# EAGLE design pcb_rfic_nrf905_final (EAGLE 9.6.1)
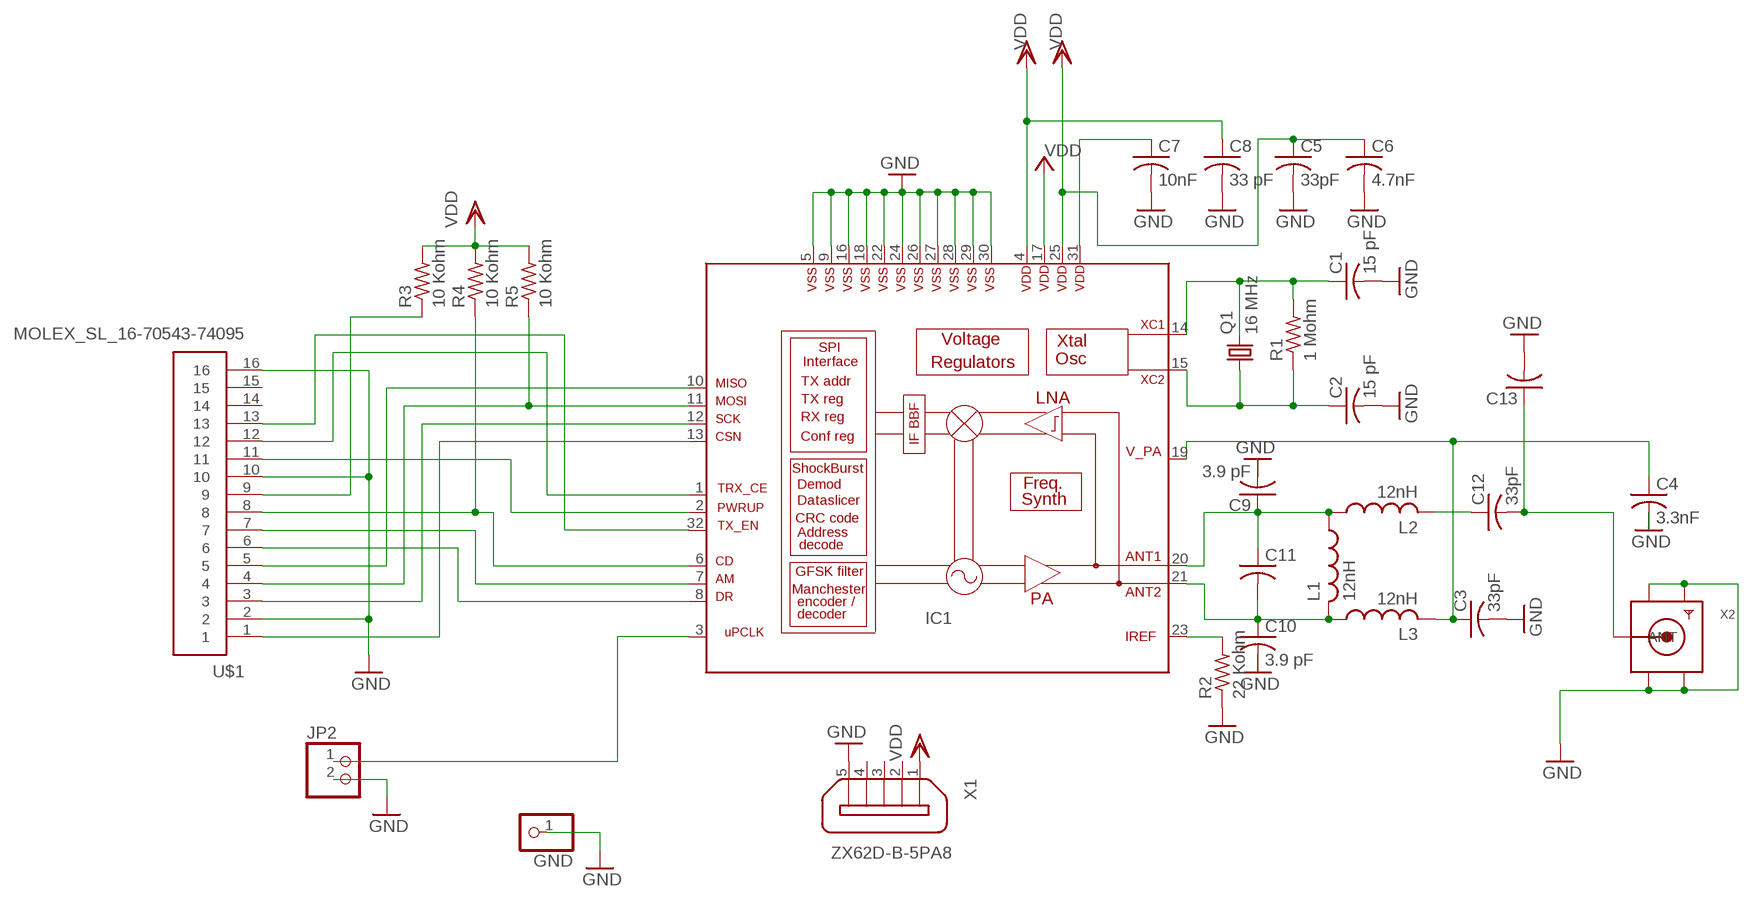
[diagram p0: schematic, sheet 1]

## Parts
C1  15 pF  C-USC0603  [C0603]
C2  15 pF  C-USC0603  [C0603]
C3  33pF  C-USC0603  [C0603]
C4  3.3nF  C-USC0603  [C0603]
C5  33pF  C-USC0603  [C0603]
C6  4.7nF  C-USC0603  [C0603]
C7  10nF  C-USC0603  [C0603]
C8  33 pF  C-USC0603  [C0603]
C9  3.9 pF  C-USC0603  [C0603]
C10  3.9 pF  C-USC0603  [C0603]
C11  C-USC0603  [C0603]
C12  33pF  C-USC0603  [C0603]
C13  C-USC0603  [C0603]
GND  PINHD-1X1  [1X01]
IC1  NRF905  [LQFP-32]
JP2  PINHD-1X2  [1X02]
L1  12nH  L-US0204V  [0204V]
L2  12nH  L-US0204V  [0204V]
L3  12nH  L-US0204V  [0204V]
Q1  16 MHz  CRYSTALHC18U-V  [HC18U-V]
R1  1 Mohm  R-US_R0603  [R0603]
R2  22 Kohm  R-US_R0603  [R0603]
R3  10 Kohm  R-US_R0603  [R0603]
R4  10 Kohm  R-US_R0603  [R0603]
R5  10 Kohm  R-US_R0603  [R0603]
U$1  MOLEX_SL_16-70543-74095  [SL_70543_16]
X1  ZX62D-B-5PA8  [ZX62D-B-5PA8]
X2  SMACONNECTOR_EDGE  [SMA_EDGELAUNCH]

## Nets
GND: C1.2 C2.2 C3.2 C4.2 C5.2 C6.2 C7.2 C8.2 C9.2 C10.2 C13.2 GND.1 IC1.5(VSS5) IC1.9(VSS9) IC1.16(VSS16) IC1.18(VSS18) IC1.22(VSS22) IC1.24(VSS24) IC1.26(VSS26) IC1.27(VSS27) IC1.28(VSS28) IC1.29(VSS29) IC1.30(VSS30) JP2.2 R2.1 U$1.2 U$1.10 U$1.16 X1.5 X2.GND@1(GND4) X2.GND@2(GND3) X2.GND@3(GND2) X2.GND@4(GND1)
N$1: C1.1 IC1.14(XC1) Q1.2 R1.2
N$2: C2.1 IC1.15(XC2) Q1.1 R1.1
N$3: IC1.23(IREF) R2.2
N$4: C7.1 IC1.31(DVDD1V2)
N$5: C9.1 C11.1 IC1.20(ANT1) L1.1 L2.1
N$7: C10.1 C11.2 IC1.21(ANT2) L1.2 L3.1
N$8: C12.1 L2.2
N$9: C3.1 C4.1 IC1.19(VDD_PA) L3.2
N$10: IC1.10(MISO) U$1.5
N$11: IC1.11(MOSI) R5.1 U$1.4
N$12: IC1.12(SCK) U$1.3
N$13: R3.1 U$1.9
N$14: IC1.1(TRX_CE) U$1.12
N$15: IC1.2(PWR_UP) U$1.11
N$16: IC1.32(TX_EN) U$1.13
N$17: IC1.6(CD) R4.1 U$1.8
N$18: IC1.7(AM) U$1.7
N$19: IC1.8(DR) U$1.6
N$20: IC1.3(UPCLK) JP2.1
N$21: IC1.13(CSN) U$1.1
N$24: C12.2 C13.1 X2.P(ANT)
VCC: IC1.17(VDD17)
VDD: C5.1 C6.1 C8.1 IC1.4(VDD4) IC1.25(VDD25) R3.2 R4.2 R5.2 X1.1
Unconnected: U$1.14 U$1.15 X1.2 X1.3 X1.4 X1.S1 X1.S2 X1.S3 X1.S4

## Library data of the parts
C1 C2 = adafruit:C-US: CAPACITOR, American symbol; MF: MULTICOMP PRO; MPN: MCMT18N150F500CT; OC_NEWARK: 03AC2905
C3 C5 C12 = adafruit:C-US: CAPACITOR, American symbol; MF: MULTICOMP PRO; MPN: MCMT18N330F100CT; OC_NEWARK: 03AC2918
C4 = adafruit:C-US: CAPACITOR, American symbol; MF: KEMET; MPN: C0603C332J5JACTU; OC_NEWARK: 01AC8337
C6 = adafruit:C-US: CAPACITOR, American symbol; MF: KEMET; MPN: C0603X472K5RAC3316; OC_NEWARK: 01AC1585
C7 = adafruit:C-US: CAPACITOR, American symbol; MF: TDK; MPN: CGA3E2C0G1H103J080AA; OC_NEWARK: 04X3152
C8 = adafruit:C-US: CAPACITOR, American symbol; MF: KEMET; MPN: C0603C330J5GACTU; OC_NEWARK: 64K2857
C9 C10 = adafruit:C-US: CAPACITOR, American symbol; MF: AVX; MPN: 06035A3R9DAT2A; OC_NEWARK: 10AH1929
C11 C13 = adafruit:C-US: CAPACITOR, American symbol; OC_NEWARK: unknown
GND = adafruit:PINHD-1X1: Pin header 1x1 for 0.1" spacing With round pins; MF: VISHAY; MPN: VO615A-1X019T; OC_NEWARK: 48W3690
IC1 = nordic-semi:NRF905: RF TRANSCEIVER; OC_NEWARK: unknown
JP2 = pinhead:PINHD-1X2: PIN HEADER; OC_NEWARK: unknown
L1-L3 = rcl:L-US: INDUCTOR, American symbol; MF: MULTICOMP PRO; MPN: MCFT000084; OC_NEWARK: 10R8619; SPICEPREFIX: L
Q1 = adafruit:CRYSTAL: CRYSTAL; OC_FARNELL: unknown; OC_NEWARK: unknown
R1 = rcl_2:R-US_: RESISTOR, American symbol; MF: MULTICOMP PRO; MPN: MCWR06X1004FTL; OC_NEWARK: 01Y7500
R2 R3 = rcl_2:R-US_: RESISTOR, American symbol; OC_NEWARK: unknown
R4 R5 = adafruit:R-US_: RESISTOR, American symbol; OC_NEWARK: unknown
U$1 = molex-sl-connectors_jw:MOLEX_SL_16: Molex SL-Series PCB Header, 16-Pos, 0.1" (2.54mm) Centers; OC_NEWARK: unknown
X1 = zx62d-b-5pa8-oshpark_10:ZX62D-B-5PA8: Micro USB Type B Connector - Standard, Shell Through Hole Source: http://www.hirose.co.jp/cataloge_hp/ed_ZX_20140804.pdf; MF: Hirose; MPN: ZX62D-B-5PA8; OC_FARNELL: 2300438; OC_NEWARK: unknown
X2 = adafruit:SMACONNECTOR: SMA Connector 90° DIP SMA Connector, 50 Ohm (4UConnector: 07259); OC_NEWARK: unknown

## Board
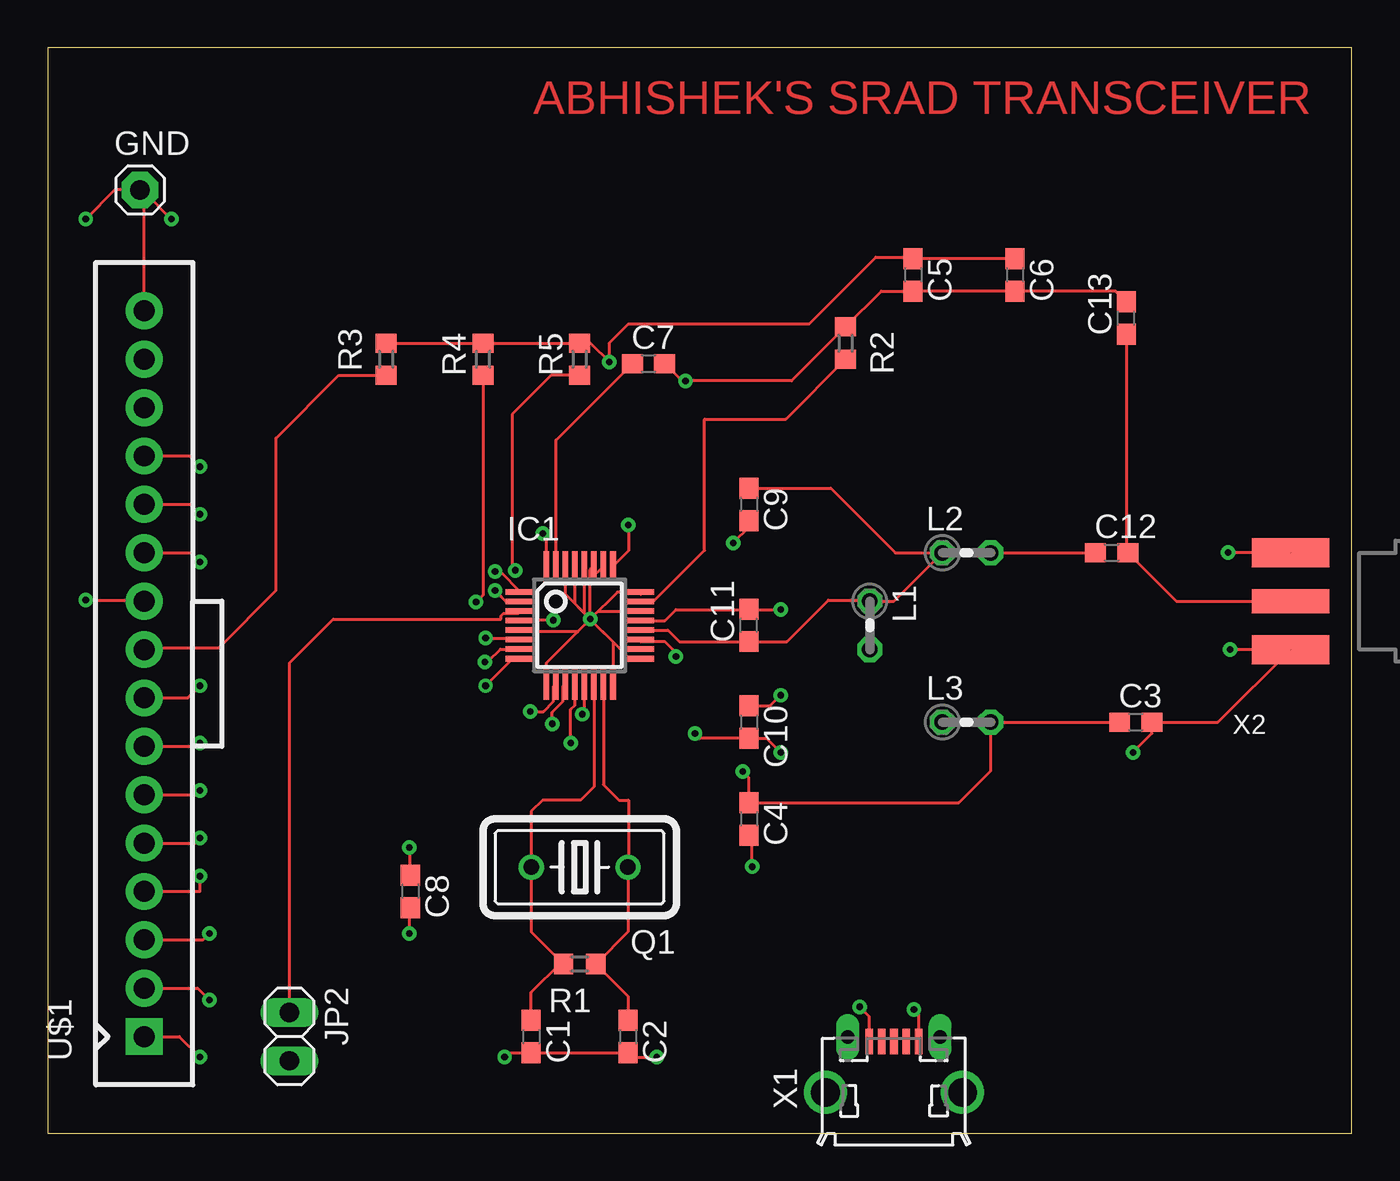
[diagram p1: board, top side]
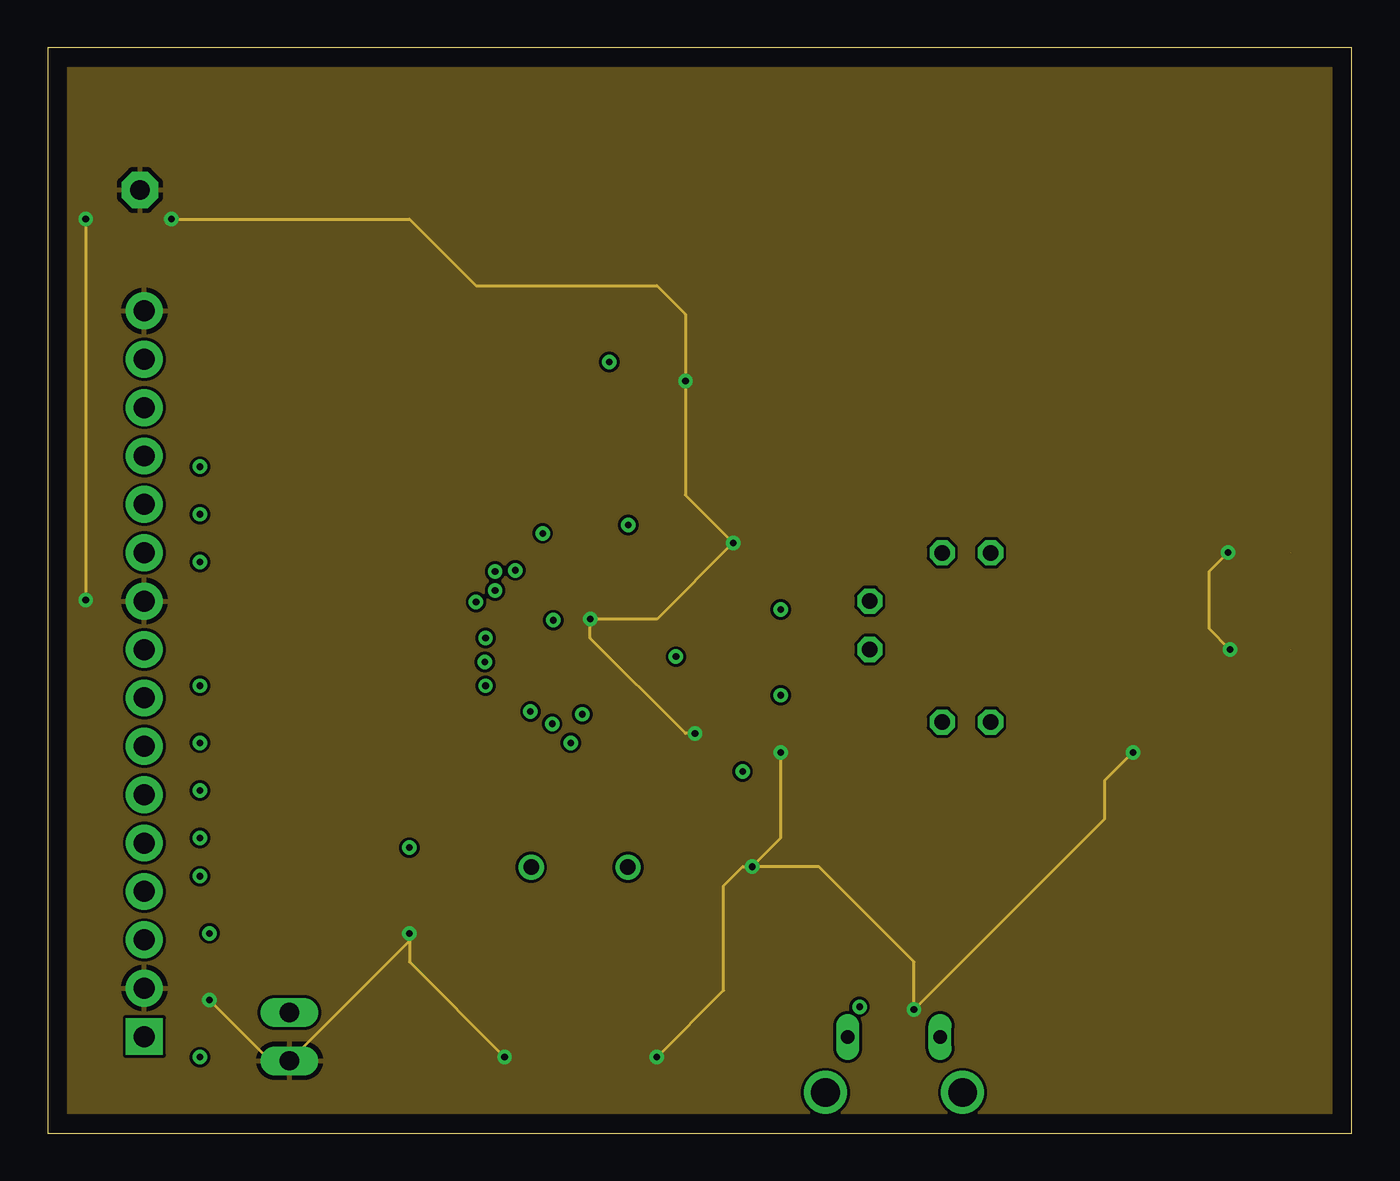
[diagram p2: board, inner layer Route2]
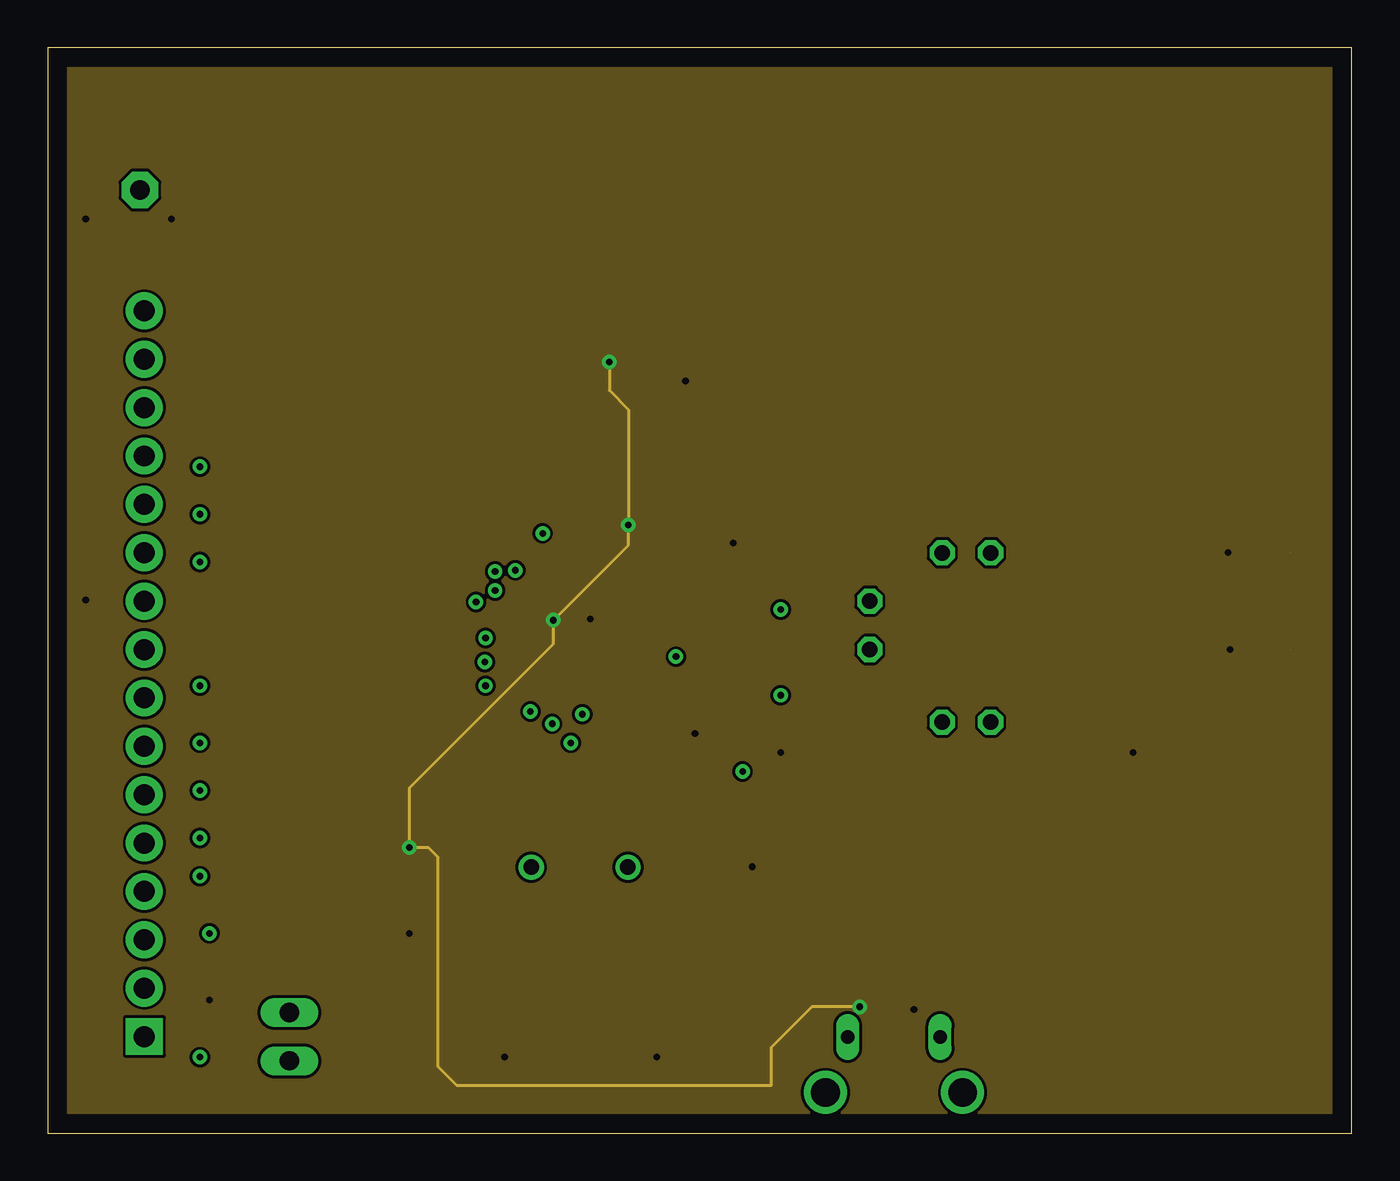
[diagram p3: board, inner layer Route15]
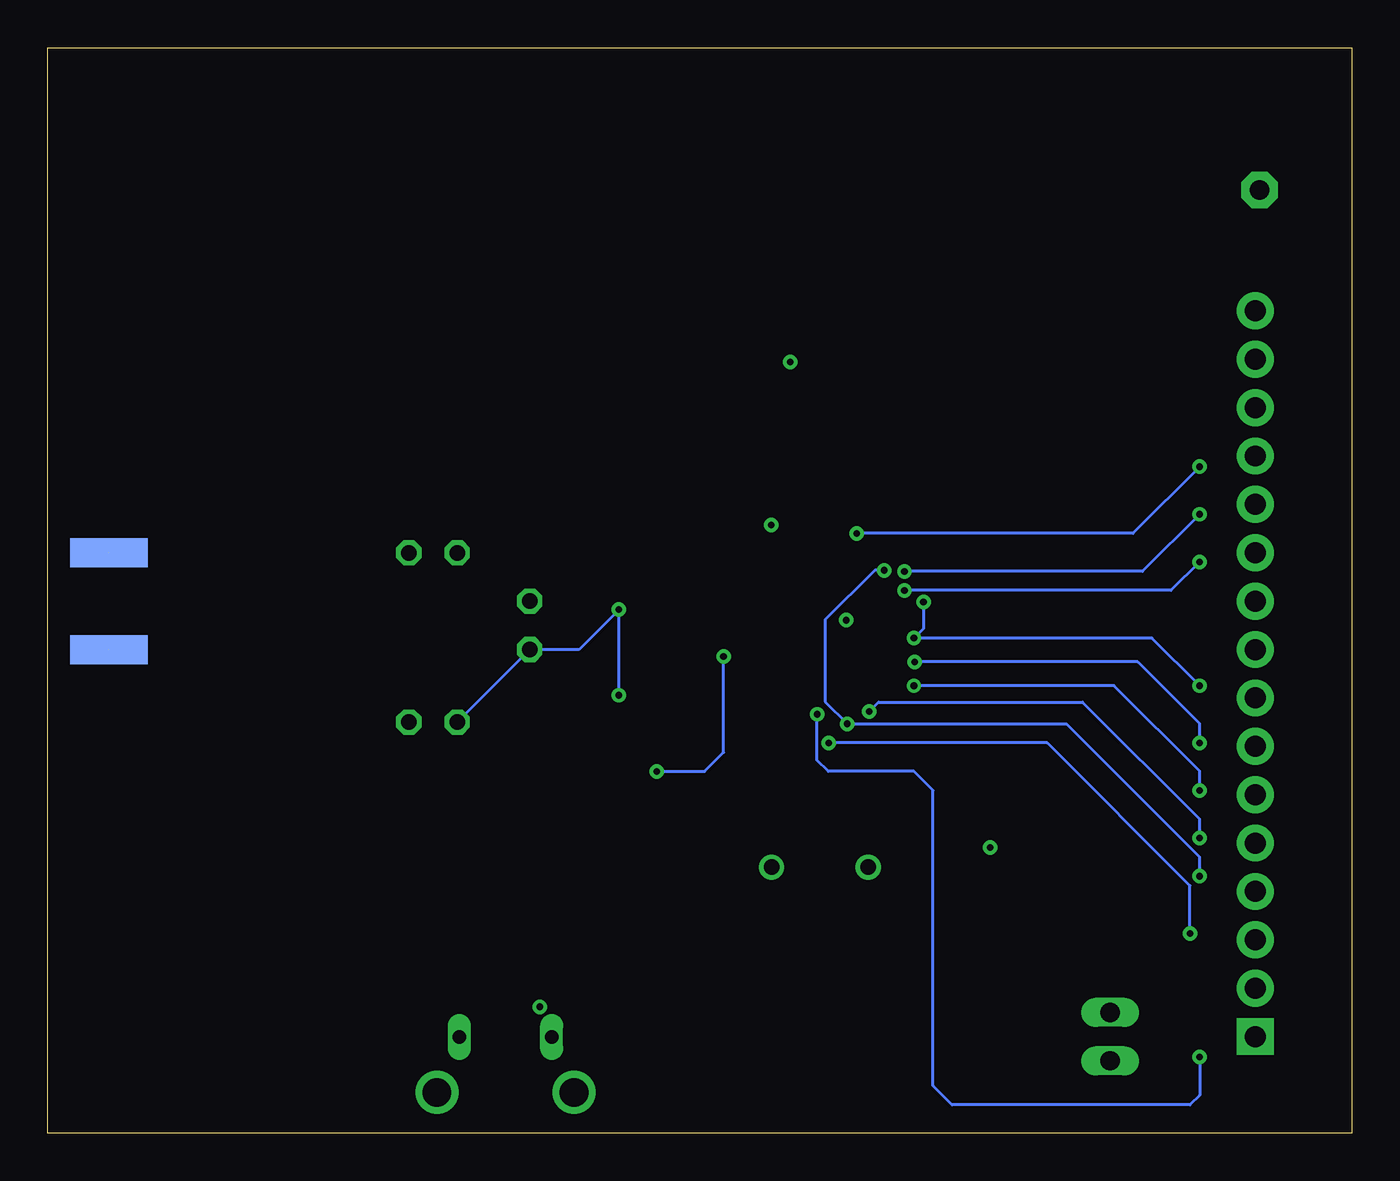
[diagram p4: board, bottom side, seen from below]

Size 68.5 x 57 mm. Coordinates in mm from the lower left corner, seen from the top.
Outline: 0,0 68.5,0 68.5,57 0,57 0,0
Copper layers ([2:1+(2*15)+16:15]): Top 0.035mm / dielectric 0.35mm / Route2 0.035mm / dielectric 0.7mm / Route15 0.035mm / dielectric 0.35mm / Bottom 0.035mm
Design rules "default *": minimum track width 6mil, minimum drill 0.35mm, track to track 6mil, track to pad 6mil, pad to pad 6mil, via to via 6mil, smd to smd 6mil, copper to edge 40mil, drill to drill 6mil, minimum pad ring 10mil, minimum via ring 8mil, stop-mask expansion 4mil, vias tented up to drill 0mil, thermal gap 10mil

### Footprints (pad centres in the part's own frame; a part is rotated, then mirrored left to right if it is on the bottom)
C0603 = smd 1.1 x 1: 1 -0.85,0; 2 0.85,0
1X01 = drill 1.016 pad 1.93 octagon: 1 0,0
LQFP-32 = smd 0.3 x 1.6: 1 -1.75,-3.1; 2 -1.25,-3.1; 3 -0.75,-3.1; 4 -0.25,-3.1; 5 0.25,-3.1; 6 0.75,-3.1; 7 1.25,-3.1; 8 1.75,-3.1; 17 1.75,3.1; 18 1.25,3.1; 19 0.75,3.1; 20 0.25,3.1; 21 -0.25,3.1; 22 -0.75,3.1; 23 -1.25,3.1; 24 -1.75,3.1 | smd 1.6 x 0.3: 9 3.1,-1.75; 10 3.1,-1.25; 11 3.1,-0.75; 12 3.1,-0.25; 13 3.1,0.25; 14 3.1,0.75; 15 3.1,1.25; 16 3.1,1.75; 25 -3.1,1.75; 26 -3.1,1.25; 27 -3.1,0.75; 28 -3.1,0.25; 29 -3.1,-0.25; 30 -3.1,-0.75; 31 -3.1,-1.25; 32 -3.1,-1.75
1X02 = drill 1.016 long: 1 -1.27,0; 2 1.27,0
0204V = drill 0.813 octagon: 1 -1.27,0; 2 1.27,0
HC18U-V = drill 0.813: 1 -2.54,0; 2 2.54,0
R0603 = smd 1 x 1.1: 1 -0.85,0; 2 0.85,0
SL_70543_16 = drill 1.1 pad 1.93 square: 1 -19.05,1.27 | drill 1.1 pad 1.93: 2 -16.51,1.27; 3 -13.97,1.27; 4 -11.43,1.27; 5 -8.89,1.27; 6 -6.35,1.27; 7 -3.81,1.27; 8 -1.27,1.27; 9 1.27,1.27; 10 3.81,1.27; 11 6.35,1.27; 12 8.89,1.27; 13 11.43,1.27; 14 13.97,1.27; 15 16.51,1.27; 16 19.05,1.27
ZX62D-B-5PA8 = smd 1.35 x 0.4: 1 4.825,1.3; 2 4.825,0.65; 3 4.825,0; 4 4.825,-0.65; 5 4.825,-1.3 | drill 1.5: S1 2.15,-3.6; S2 2.15,3.6 | drill 0.7 long: S3 5.05,2.425; S4 5.05,-2.425
SMA_EDGELAUNCH = smd 4.064 x 1.524: GND@1 2.032,-2.54; GND@2 2.032,2.54 | smd 4.064 x 1.524 bottom: GND@3 2.032,2.54; GND@4 2.032,-2.54 | smd 4.064 x 1.27: P 2.032,0

### Placement (x,y rotation side)
C1  25.4,5.08 270 top
C2  30.48,5.08 270 top
C3  57.15,21.59 0 top
C4  36.83,16.51 270 top
C5  45.45,45.07 270 top
C6  50.8,45.07 270 top
C7  31.56,40.41 0 top
C8  19.05,12.7 270 top
C9  36.83,33.02 270 top
C10  36.83,21.59 270 top
C11  36.83,26.67 90 top
C12  55.88,30.48 0 top
C13  56.65,42.8 90 top
GND  4.85,49.53 0 top
IC1  27.94,26.67 270 top
JP2  12.7,5.08 270 top
L1  43.18,26.67 270 top
L2  48.26,30.48 0 top
L3  48.26,21.59 0 top
Q1  27.94,13.97 180 top
R1  27.94,8.89 180 top
R2  41.91,41.49 270 top
R3  17.78,40.64 90 top
R4  22.86,40.64 90 top
R5  27.94,40.64 90 top
U$1  6.35,24.13 90 top
X1  44.45,0 90 top
X2  67.31,27.94 180 top

### Tracks (layer width: path | path; a pad name or v marks a point on that pad's centre or on a via)
GND  (via drill 0.35 layers 1-2)  (2 unrouted)
  Top 0.152: 5.08,49.42 v6.5,48 | v2,48 3.53,49.53 GND.1 4.97,49.53 5.08,49.42 | v2,28 5.02,28 U$1.10 | U$1.16 5.08,49.42 | C7.2 33.32,39.5 v33.5,39.5 39.07,39.5 R2.1 43.79,44.22 C5.2 C6.2 56.08,44.22 C13.2 | U$1.2 7.88,7.62 v8.5,7 | v19,10.5 19,11.8 C8.2 | v24,4 24.23,4.23 C1.2 C2.2 30.71,4 v32,4 | v37,14 37,15.49 C4.2 | X1.5 45.75,6.25 v45.5,6.5 | v57,20 58,21 C3.2 61.47,21.59 X2.GND@3 v62.1,25.4 | v38.5,20 37.76,20.74 C10.2 34.26,20.74 v34,21 | v62,30.5 65.26,30.5 X2.GND@4 | C9.2 36.83,31.83 v36,31 | v28.5,27 28.92,27.42 IC1.22 | 31.16,28.3 IC1.24 29.92,28.42 v28.5,27 | v28.5,27 30.08,25.42 IC1.18 | v28.5,27 29.69,25.81 IC1.16 | v28.5,27 26.19,24.69 IC1.9 | IC1.5 25.72,26.42 25.81,26.33 27.83,26.33 v28.5,27 | v28.5,27 27.19,28.31 IC1.30 | v28.5,27 27.69,27.81 IC1.29 | v28.5,27 28.19,27.31 IC1.28 | v28.5,27 28.5,29.58 IC1.27 | v28.5,27 28.5,29.08 IC1.26
  Route2 0.152: v2,48 v2,28 | 6.26,47.76 v6.5,48 19,48 22.5,44.5 32,44.5 33.5,43 v33.5,39.5 33.5,33.5 v36,31 32,27 v28.5,27 28.5,26 33.5,21 v34,21 | v8.5,7 11.69,3.81 JP2.2 19,10.11 v19,10.5 19,9 v24,4 | v37,14 36.5,14 35.5,13 35.5,7.5 v32,4 | v57,20 55.5,18.5 55.5,16.5 v45.5,6.5 45.5,9 40.5,14 v37,14 | v38.5,20 38.5,15.5 v37,14 | v62.1,25.4 61,26.5 61,29.5 v62,30.5
  pour Route2: -0.5,-0.5 -0.5,57.5 69,57.5 69,-0.5
N$1
  Top 0.152: IC1.14 28.69,18.19 28,17.5 26,17.5 25.4,16.9 Q1.2 25.4,10.58 26.99,8.99 | 26.99,8.99 R1.2 | C1.1 25.4,7.4 26.99,8.99
N$2
  Top 0.152: IC1.15 29.19,18.31 30,17.5 30.5,17.5 30.5,13.99 Q1.1 30.48,10.58 R1.1 30.48,7.2 C2.1
N$3
  Top 0.152: IC1.23 31.11,27.99 31.89,27.99 34.5,30.61 34.5,37.5 38.77,37.5 R2.2
N$4
  Top 0.152: IC1.31 26.69,36.39 C7.1
N$5
  Top 0.152: C9.1 41.13,33.87 44.52,30.48 L2.1 44.45,27.94 L1.1 43.12,28 41,28 38.82,25.82 C11.1 33.18,25.82 32.58,26.42 IC1.20
N$7  (via drill 0.35)
  Top 0.152: C11.2 36.85,27.5 | 36.85,27.5 v38.5,27.5 | IC1.21 32.42,26.92 33,27.5 36.85,27.5 | C10.1 37.94,22.44 v38.5,23
  Bottom 0.152: v38.5,23 v38.5,27.5 40.6,25.4 L1.2 L3.1
N$8
  Top 0.152: L2.2 C12.1
N$9  (via drill 0.35)
  Top 0.152: v36.5,19 36.83,18.67 C4.1 47.86,17.36 49.53,19.03 L3.2 C3.1 | IC1.19 31.16,25.8 32.44,25.8 33,25.23 v33,25.03
  Bottom 0.152: v36.5,19 34,19 33,20 v33,25.03
N$10  (via drill 0.35)
  Top 0.152: U$1.5 7.74,15.24 v8,15.5 | IC1.10 26.57,23.45 26.57,22.68 26.04,22.14 v25.36,22.14
  Bottom 0.152: v8,15.5 8,16.5 14.14,22.64 24.86,22.64 v25.36,22.14
N$11  (via drill 0.35)
  Top 0.152: U$1.4 8,12.7 v8,13.5 | IC1.11 27.07,23.45 27.07,22.68 26.5,22.11 v26.5,21.5 | v24.56,29.56 24.39,29.73 24.39,37.75 26.43,39.79 R5.1
  Bottom 0.152: v8,13.5 8,14.5 15,21.5 v26.5,21.5 27.67,22.67 27.67,26.95 25.06,29.56 v24.56,29.56
N$12  (via drill 0.35)
  Top 0.152: U$1.3 8.16,10.16 v8.5,10.5 | IC1.12 27.69,22.46 27.48,22.25 v27.48,20.5
  Bottom 0.152: v8.5,10.5 8.5,13 16,20.5 v27.48,20.5
N$13
  Top 0.152: U$1.9 5.18,25.5 9,25.5 12,28.5 12,36.5 15.29,39.79 R3.1
N$14  (via drill 0.35)
  Top 0.152: U$1.12 7.48,33.02 v8,32.5 | v23.5,29.5 23.76,29.5 IC1.1
  Bottom 0.152: v8,32.5 11,29.5 v23.5,29.5
N$15  (via drill 0.35)
  Top 0.152: U$1.11 7.52,30.48 v8,30 | v23.5,28.5 23.81,28.19 23.81,28.18 24.07,27.92 IC1.2
  Bottom 0.152: v8,30 9.5,28.5 v23.5,28.5
N$16  (via drill 0.35)
  Top 0.152: U$1.13 7.44,35.56 v8,35 | v26,31.5 26.19,31.31 IC1.32
  Bottom 0.152: v8,35 11.5,31.5 v26,31.5
N$17  (via drill 0.35)
  Top 0.152: U$1.8 7.36,22.86 v8,23.5 | v23,26 24.76,26 IC1.6 | R4.1 22.86,28.25 v22.5,27.89
  Bottom 0.152: v8,23.5 10.5,26 v23,26 22.5,26.5 v22.5,27.89
N$18  (via drill 0.35)
  Top 0.152: U$1.7 7.82,20.32 v8,20.5 | IC1.7 23.78,25.42 23.11,24.75 v22.96,24.75
  Bottom 0.152: v8,20.5 8,21.5 11.25,24.75 v22.96,24.75
N$19  (via drill 0.35)
  Top 0.152: U$1.6 7.78,17.78 v8,18 | IC1.8 24.42,24.92 v23,23.5
  Bottom 0.152: v8,18 8,19 12.5,23.5 v23,23.5
N$20
  Top 0.152: JP2.1 12.7,24.7 15,27 23.81,27 23.81,27.16 23.95,27.3 24.72,27.3 IC1.3
N$21  (via drill 0.35)
  Top 0.152: U$1.1 6.92,5.08 v8,4 | v28.08,22 28.19,22.11 IC1.13
  Bottom 0.152: v8,4 8,2 8.5,1.5 21,1.5 22,2.5 22,18 23,19 27.5,19 28.08,19.58 v28.08,22
N$24
  Top 0.152: C13.1 56.65,30.56 C12.2 59.27,27.94 X2.P
VDD  (via drill 0.35)
  Top 0.152: R3.2 R4.2 R5.2 28.51,41.49 v29.5,40.5 29.5,41.5 30.5,42.5 40,42.5 43.5,46 45.37,46 C5.1 C6.1 | C8.1 19.05,14.95 v19,15 | v26.56,26.94 24.86,26.94 IC1.4 | v30.5,31.94 30.5,30.58 IC1.25 | X1.1 43.15,6.13 v42.64,6.64
  Route15 0.152: v29.5,40.5 29.5,39 30.5,38 v30.5,31.94 30.5,30.88 v26.56,26.94 26.56,25.7 19,18.14 v19,15 20,15 20.5,14.5 20.5,3.5 21.5,2.5 38,2.5 38,4.5 40.14,6.64 v42.64,6.64
  pour Route15: -1,-1 -1,58 69.5,58 69.5,-1

### Text on the board
Top: ABHISHEK'S SRAD TRANSCEIVER